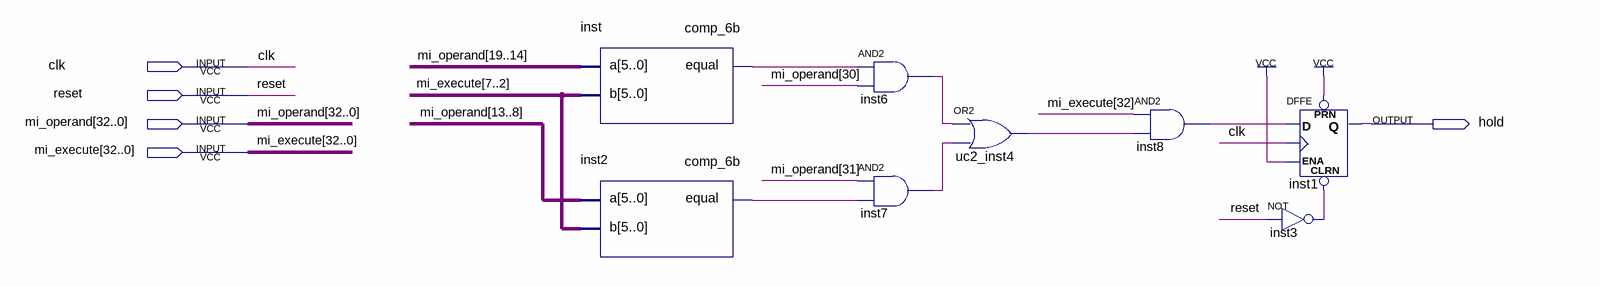
[diagram p0: schematic sheet]
// Quartus schematic uc_register_dependency.bdf as structural Verilog: 8 symbols, 5 pins
module uc_register_dependency (
  input  clk,
  input  reset,
  input  [32:0] mi_operand,
  input  [32:0] mi_execute,
  output hold
);

  wire inst2_equal, inst3_out, inst6_out, inst7_out, inst8_out, inst_equal, uc2_inst4_out;

  comp_6b inst (.a(mi_operand[19:14]), .b(mi_execute[7:2]), .equal(inst_equal));
  comp_6b inst2 (.a(mi_operand[13:8]), .b(mi_execute[7:2]), .equal(inst2_equal));
  and inst6 (inst6_out, inst_equal, mi_operand[30]);
  and inst7 (inst7_out, mi_operand[31], inst2_equal);
  or uc2_inst4 (uc2_inst4_out, inst6_out, inst7_out);
  and inst8 (inst8_out, mi_execute[32], uc2_inst4_out);
  DFFE inst1 (.PRN(1'b1), .CLRN(inst3_out), .D(inst8_out), .CLK(clk), .ENA(1'b1), .Q(hold));
  not inst3 (inst3_out, reset);
endmodule
